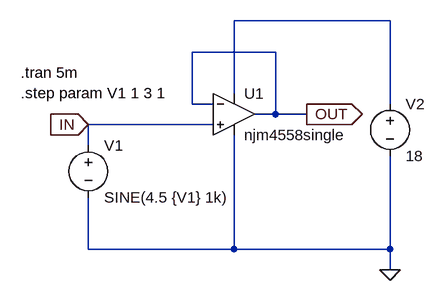
[diagram p0: schematic Circuit7_05.asc]
Circuit7_05.asc, the LTspice schematic file:
Version 4
SHEET 1 880 680
WIRE 400 96 160 96
WIRE 224 144 96 144
WIRE 160 208 160 96
WIRE 96 224 96 144
WIRE 128 224 96 224
WIRE 400 224 400 96
WIRE 224 240 224 144
WIRE 224 240 192 240
WIRE 272 240 224 240
WIRE 128 256 -64 256
WIRE -64 288 -64 256
WIRE -64 448 -64 368
WIRE 160 448 160 272
WIRE 160 448 -64 448
WIRE 400 448 400 304
WIRE 400 448 160 448
WIRE 400 480 400 448
FLAG 400 480 0
FLAG -64 256 IN
IOPIN -64 256 In
FLAG 272 240 OUT
IOPIN 272 240 Out
SYMBOL voltage -64 272 R0
SYMATTR InstName V1
SYMATTR Value SINE(4.5 {V1} 1k)
SYMBOL voltage 400 208 R0
SYMATTR InstName V2
SYMATTR Value 18
SYMBOL NJR_OPamp/njm4558single 160 176 R0
SYMATTR InstName U1
TEXT -168 176 Left 2 !.tran 5m\n.step param V1 1 3 1

The netlist it stands for:
* Circuit7_05.asc
V1 IN 0 SINE(4.5 {V1} 1k)
V2 N001 0 18
* U1: njm4558single (symbol NJR_OPamp/njm4558single not available, pins judged from their places): In+=IN In-=OUT V+=N001 V-=0 OUT=OUT
.tran 5m
.step param V1 1 3 1
.backanno
.end